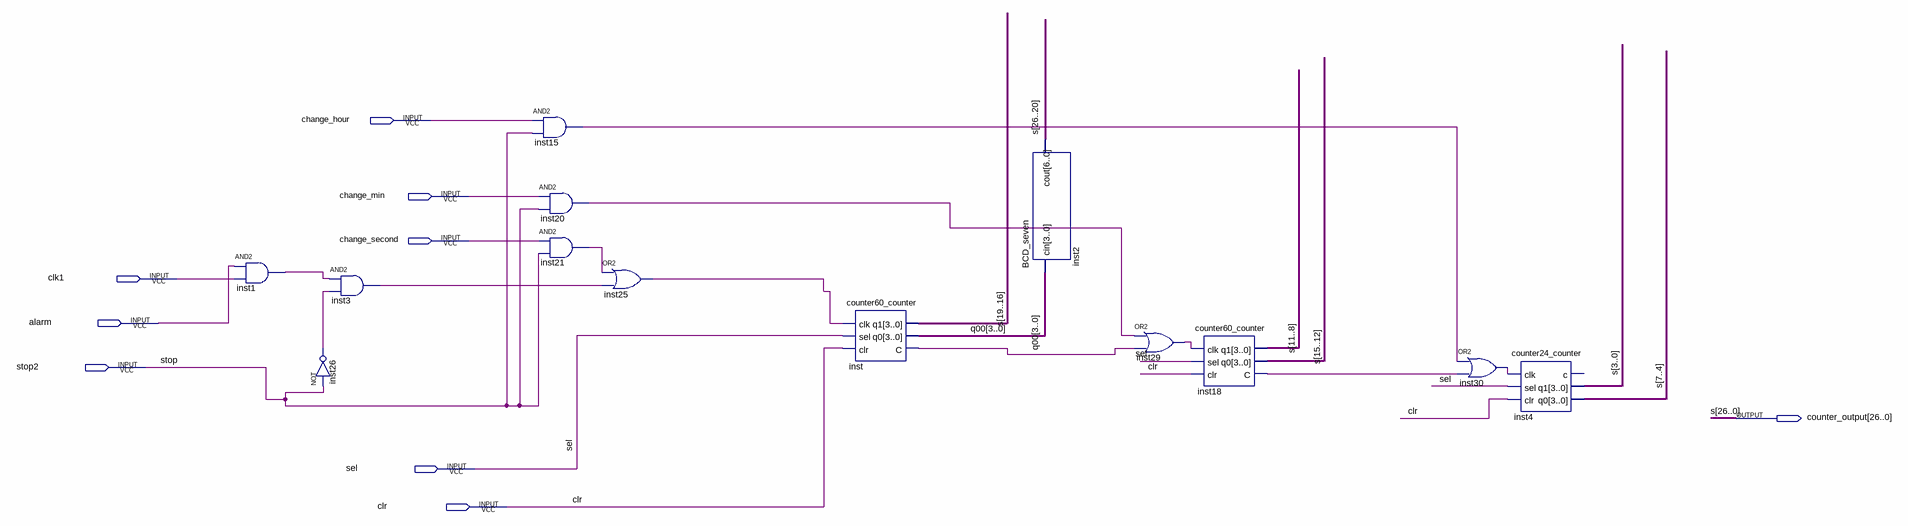
[diagram p0: schematic sheet]
// Quartus schematic e_clock_counter.bdf as structural Verilog: 13 symbols, 9 pins
module e_clock_counter (
  input  change_hour,
  input  change_min,
  input  change_second,
  input  clk1,
  input  alarm,
  input  stop2,
  input  sel,
  input  clr,
  output [26:0] counter_output
);

  wire inst1_out, inst3_out, inst15_out, inst18_c, inst20_out, inst21_out, inst25_out, inst26_out,
       inst29_out, inst30_out, inst_c;
  wire [3:0] q00;

  and inst1 (inst1_out, alarm, clk1);
  and inst3 (inst3_out, inst1_out, inst26_out);
  not inst26 (inst26_out, stop2);
  and inst15 (inst15_out, change_hour, stop2);
  and inst20 (inst20_out, change_min, stop2);
  and inst21 (inst21_out, change_second, stop2);
  or inst25 (inst25_out, inst21_out, inst3_out);
  counter60_counter inst (.clk(inst25_out), .sel(sel), .clr(clr), .C(inst_c), .q1(counter_output[19:16]), .q0(q00));
  BCD_seven inst2 (.cin(q00), .cout(counter_output[26:20]));
  or inst29 (inst29_out, inst20_out, inst_c);
  counter60_counter inst18 (
    .clk(inst29_out), .sel(sel), .clr(clr), .C(inst18_c), .q1(counter_output[11:8]),
    .q0(counter_output[15:12]));
  or inst30 (inst30_out, inst15_out, inst18_c);
  counter24_counter inst4 (
    .clk(inst30_out), .sel(sel), .clr(clr), .q1(counter_output[3:0]), .q0(counter_output[7:4]));  // open: c

  // Other names for the same wires on the sheet: s[26:0] = counter_output; stop = stop2
endmodule
